# EAGLE design ProSense (EAGLE 7.2.0)
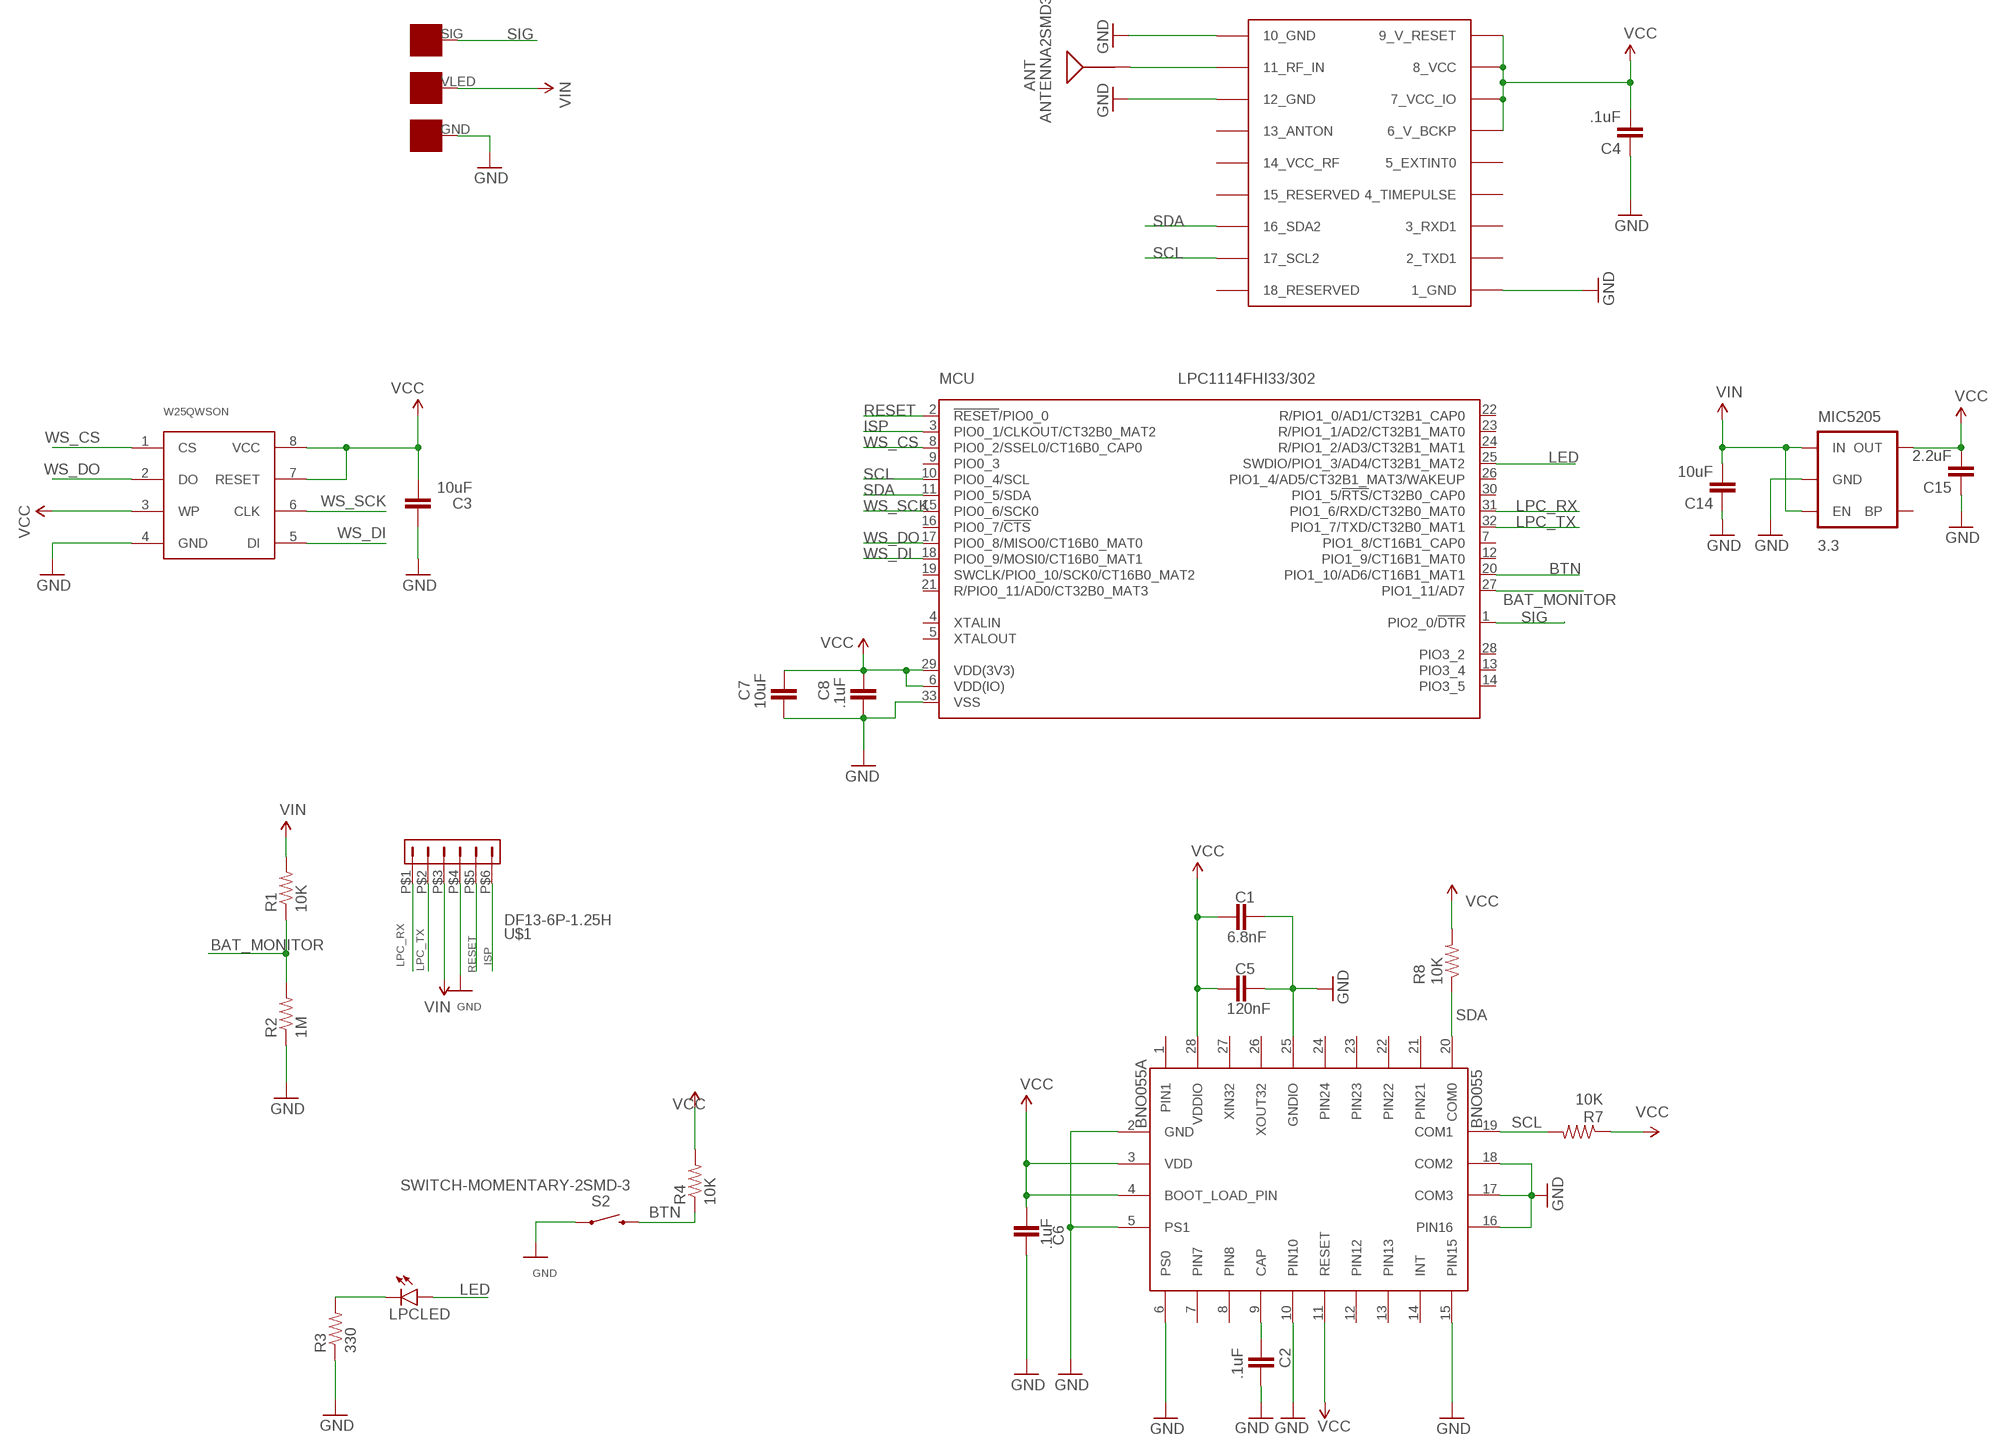
[diagram p0: schematic, sheet 1]

## Parts
ANT  ANTENNA2SMD3  [ANTENNA-CHIP4]
BNO055  BNO055A  [BNO055]
C1  6.8nF  CAP0603-CAP  [0603-CAP]
C2  .1uF  CAP0603-CAP  [0603-CAP]
C3  10uF  CAP0603-CAP  [0603-CAP]
C4  .1uF  CAP0603-CAP  [0603-CAP]
C5  120nF  CAP0603-CAP  [0603-CAP]
C6  .1uF  CAP0603-CAP  [0603-CAP]
C7  10uF  CAP0603-CAP  [0603-CAP]
C8  .1uF  CAP0603-CAP  [0603-CAP]
C14  10uF  CAP0603-CAP  [0603-CAP]
C15  2.2uF  CAP0603-CAP  [0603-CAP]
LPCLED  LED0603  [LED-0603]
MCU  LPC1114FHI33/302  [SOT617-3]
MIC5205  3.3  MIC52053.3V  [SOT23-5]
R1  10K  RESISTOR0603-RES  [0603-RES]
R2  1M  RESISTOR0603-RES  [0603-RES]
R3  330  RESISTOR0603-RES  [0603-RES]
R4  10K  RESISTOR0603-RES  [0603-RES]
R7  10K  RESISTOR0603-RES  [0603-RES]
R8  10K  RESISTOR0603-RES  [0603-RES]
S2  SWITCH-MOMENTARY-2SMD-3  [TACTILE_SWITCH_SMD-3]
U$1  DF13-6P-1.25H  [DF13A-6P-1.25H]
U$2  UBLOX_MAX  [UBLOX_MAX]
U$4  CON  [COPPER-PAD]
W25QWSON  W25Q128FVWSON  [WSON-8-PAD]

## Nets
BAT_MONITOR: MCU.27(PIO1_11/AD7) R1.1 R2.2
BTN: MCU.20(PIO1_10/AD6/CT16B1_MAT1) R4.1 S2.4
GND: BNO055.2(GND) BNO055.5(PS1) BNO055.6(PS0) BNO055.10(PIN10) BNO055.15(PIN15) BNO055.16(PIN16) BNO055.17(COM3) BNO055.18(COM2) BNO055.25(GNDIO) C1.1 C2.1 C3.1 C4.1 C5.1 C6.2 C7.2 C8.2 C14.1 C15.1 MCU.33(VSS) MIC5205.2(GND) R2.1 R3.1 S2.1 U$1.P$4 U$2.1_GND U$2.10_GND U$2.12_GND U$4.GND W25QWSON.4(GND)
ISP: MCU.3(PIO0_1/CLKOUT/CT32B0_MAT2) U$1.P$6
LED: LPCLED.A MCU.25(SWDIO/PIO1_3/AD4/CT32B1_MAT2)
LPC_RX: MCU.31(PIO1_6/RXD/CT32B0_MAT0) U$1.P$1
LPC_TX: MCU.32(PIO1_7/TXD/CT32B0_MAT1) U$1.P$2
N$1: ANT.SIG(SIGNAL) U$2.11_RF_IN
N$2: BNO055.9(CAP) C2.2
N$5: LPCLED.C R3.2
RESET: MCU.2(!RESET!/PIO0_0) U$1.P$5
SCL: BNO055.19(COM1) MCU.10(PIO0_4/SCL) R7.2 U$2.17_SCL2
SDA: BNO055.20(COM0) MCU.11(PIO0_5/SDA) R8.1 U$2.16_SDA2
SIG: MCU.1(PIO2_0/!DTR!) U$4.SIG
VCC: BNO055.3(VDD) BNO055.4(BOOT_LOAD_PIN) BNO055.11(RESET) BNO055.28(VDDIO) C1.2 C3.2 C4.2 C5.2 C6.1 C7.1 C8.1 C15.2 MCU.6(VDD(IO)) MCU.29(VDD(3V3)) MIC5205.5(OUT) R4.2 R7.1 R8.2 U$2.6_V_BCKP U$2.7_VCC_IO U$2.8_VCC U$2.9_V_RESET W25QWSON.3(WP) W25QWSON.7(RESET) W25QWSON.8(VCC)
VIN: C14.2 MIC5205.1(IN) MIC5205.3(EN) R1.2 U$1.P$3 U$4.VLED
WS_CS: MCU.8(PIO0_2/SSEL0/CT16B0_CAP0) W25QWSON.1(CS)
WS_DI: MCU.18(PIO0_9/MOSI0/CT16B0_MAT1) W25QWSON.5(DI)
WS_DO: MCU.17(PIO0_8/MISO0/CT16B0_MAT0) W25QWSON.2(DO)
WS_SCK: MCU.15(PIO0_6/SCK0) W25QWSON.6(CLK)
Unconnected: BNO055.1(PIN1) BNO055.7(PIN7) BNO055.8(PIN8) BNO055.12(PIN12) BNO055.13(PIN13) BNO055.14(INT) BNO055.21(PIN21) BNO055.22(PIN22) BNO055.23(PIN23) BNO055.24(PIN24) BNO055.26(XOUT32) BNO055.27(XIN32) MCU.4(XTALIN) MCU.5(XTALOUT) MCU.7(PIO1_8/CT16B1_CAP0) MCU.9(PIO0_3) MCU.12(PIO1_9/CT16B1_MAT0) MCU.13(PIO3_4) MCU.14(PIO3_5) MCU.16(PIO0_7/!CTS!) MCU.19(SWCLK/PIO0_10/SCK0/CT16B0_MAT2) MCU.21(R/PIO0_11/AD0/CT32B0_MAT3) MCU.22(R/PIO1_0/AD1/CT32B1_CAP0) MCU.23(R/PIO1_1/AD2/CT32B1_MAT0) MCU.24(R/PIO1_2/AD3/CT32B1_MAT1) MCU.26(PIO1_4/AD5/CT32B1_MAT3/WAKEUP) MCU.28(PIO3_2) MCU.30(PIO1_5/!RTS!/CT32B0_CAP0) MIC5205.4(BP) U$2.2_TXD1 U$2.3_RXD1 U$2.4_TIMEPULSE U$2.5_EXTINT0 U$2.13_ANTON U$2.14_VCC_RF U$2.15_RESERVED U$2.18_RESERVED

## Library data of the parts
ANT = SparkFun-RF:ANTENNA2: Chip antenna Single endded antenna. Common with smaller chip antennas. CHIP4 package is the GPS Chip Antenna SKU: GPS-08418. CHIP5 package is 2.4GHz chip antenna SKU: WRL-00144.
BNO055 = BNO055:BNO055
C1-C8 C14 C15 = SparkFun-Passives:CAP: Capacitor Standard 0603 ceramic capacitor, and 0.1" leaded capacitor.
LPCLED = SparkFun-LED:LED: LEDs Standard schematic elements and footprints for 5mm, 3mm, 1206, and 0603 sized LEDs. 5mm - Spark Fun Electronics SKU : COM-00529 (and others)
MCU = NXP_60_26022015:LPC1114FHI33/302: 32-bit ARM Cortex-M0 microcontroller; up to 64 kB flash and 8 kB SRAM The LPC1110/11/12/13/14/15 are a ARM Cortex-M0 based, low-cost 32-bit MCU family, designed for 8/16-bit microcontroller applications, offering performance, low power, simple instruction set and memory addressing together with reduced code size compared to existing 8/16-bit architectures. The LPC1110/11/12/13/14/15 operate at CPU frequencies of up to 50 MHz. The peripheral complement of the LPC1110/11/12/13/14/15 includes up to 64 kB of flash memory, up to 8 kB of data memory, one Fast-mode Plus I 2 C-bus interface, one RS-485/EIA-485 UART, up to two SPI interfaces with SSP features, four general purpose counter/timers, a 10-bit ADC, and up to 42 general purpose I/O pins. Remark: The LPC111x series consists of the LPC1100 series (parts LPC111x/101/201/301), LPC1100L series (parts LPC111x/002/102/202/302), and the LPC1100XL series (parts LPC111x/103/203/303/323/333). The LPC1100L and LPC1100XL series include the power profiles, a windowed watchdog timer, and a configurable open-drain mode. AAL Eindhoven MK; ADC: 8; FLASH: 32kB; GPIO: 28; PWR_PROFILES: yes; SERIES: LPC1100L; SPI: 1; SRAM: 8kB
MIC5205 = SparkFun-PowerIC:MIC5205: MIC5205 150mA vreg 3.3V - VREG-00822 5V - VREG-00823; PROD_ID: VREG-00822
R1-R4 R7 R8 = SparkFun-Passives:RESISTOR: Resistor Basic schematic elements and footprints for 0603, 1206, and PTH resistors.
S2 = SparkFun-Electromechanical:SWITCH-MOMENTARY-2: Various NO switches- pushbuttons, reed, etc
U$1 = con-hirose-df13:DF13-6P-1.25: DF13-6P 1.25mm Pitch Miniature Crimping Connector.
U$2 = Ava:UBLOX_MAX: UBLOX MAX
U$4 = Matts-Parts:CON
W25QWSON = Matts-Parts:W25Q128FV: W25Q128FV - SPI Flash Memory Technical Specifications: VCC: 2.6-3.7V Memory Size: 128Mbit or 16Mbytes SPI ~ 100Mhz Digikey: W25Q128FVSIG

## Board
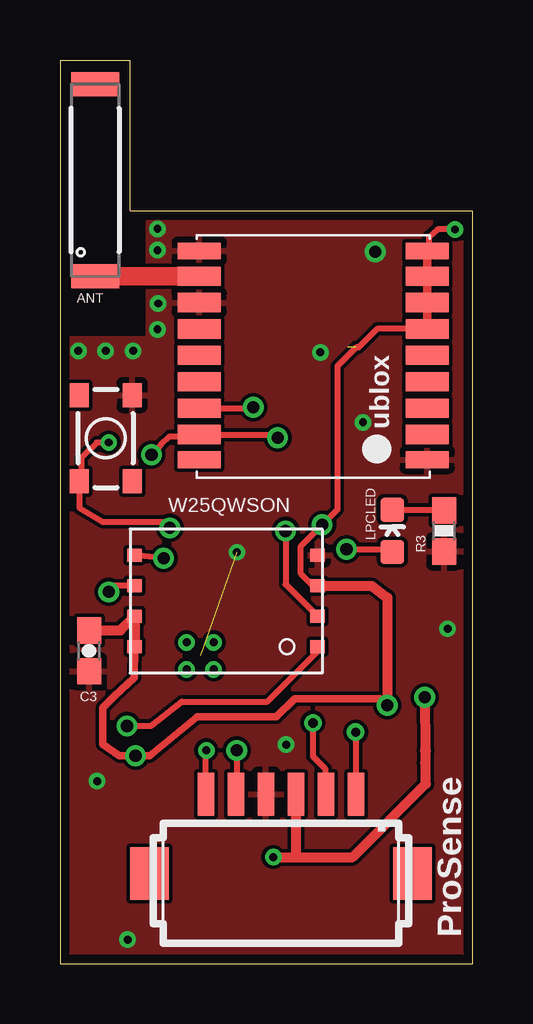
[diagram p1: board, top side]
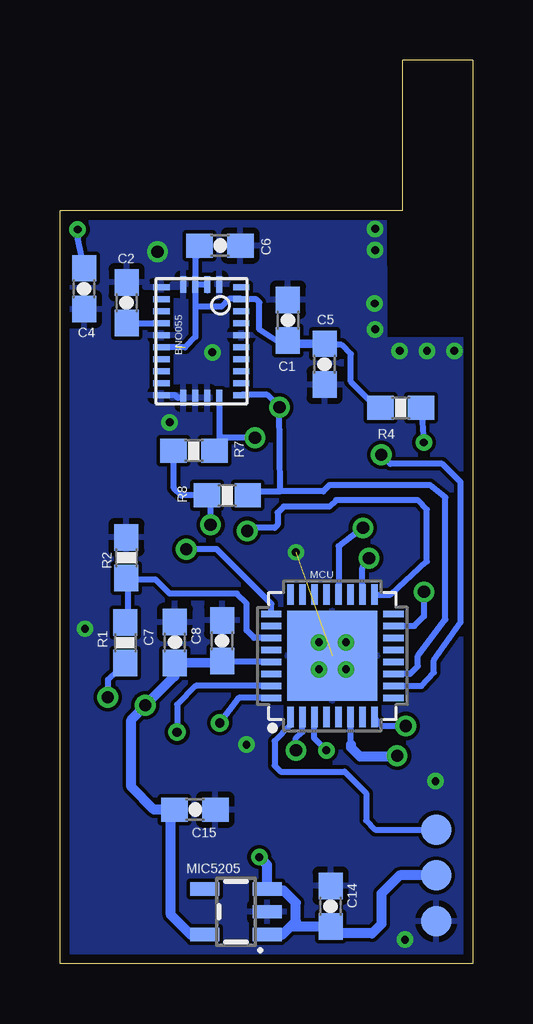
[diagram p2: board, bottom side, seen from below]

Size 17.2 x 37.66 mm. Coordinates in mm from the lower left corner, seen from the top.
Outline: 0,0 17.2,0 17.2,31.37 2.92,31.37 2.92,37.66 0,37.66 0,0
Copper layers (1*16): Top 0.0356mm / dielectric 1.5011mm / Bottom 0.0356mm
Design rules "OSHPARK": minimum track width 6mil, minimum drill 13mil, track to track 6mil, track to pad 6mil, pad to pad 6mil, via to via 6mil, smd to smd 6mil, copper to edge 15mil, drill to drill 6mil, minimum pad ring 7mil, minimum via ring 7mil, stop-mask expansion 3mil, vias tented up to drill 0mil, thermal gap 10mil

### Footprints (pad centres in the part's own frame; a part is rotated, then mirrored left to right if it is on the bottom)
ANTENNA-CHIP4 = smd 1 x 2: NC 4,0; SIG -4,0
BNO055 = smd 0.675 x 0.25: 1 1.663,2.25; 6 -1.665,2.25; 7 -1.665,1.75; 8 -1.665,1.25; 9 -1.665,0.75; 10 -1.665,0.25; 11 -1.665,-0.25; 12 -1.665,-0.75; 13 -1.665,-1.25; 14 -1.665,-1.75; 15 -1.665,-2.25; 20 1.663,-2.25; 21 1.663,-1.75; 22 1.663,-1.25; 23 1.663,-0.75; 24 1.663,-0.25; 25 1.663,0.25; 26 1.663,0.75; 27 1.663,1.25; 28 1.663,1.75 | smd 0.25 x 0.675: 2 0.75,2.362; 3 0.25,2.362; 4 -0.25,2.362; 5 -0.75,2.362; 16 -0.75,-2.362; 17 -0.25,-2.362; 18 0.25,-2.362; 19 0.75,-2.362
0603-CAP = smd 1.1 x 1: 1 -0.85,0; 2 0.85,0
LED-0603 = smd 1 x 1: A 0,-0.877; C 0,0.877
SOT617-3 = smd 0.85 x 0.27: 1 -2.55,1.75; 2 -2.55,1.25; 3 -2.55,0.75; 4 -2.55,0.25; 5 -2.55,-0.25; 6 -2.55,-0.75; 7 -2.55,-1.25; 8 -2.55,-1.75; 17 2.55,-1.75; 18 2.55,-1.25; 19 2.55,-0.75; 20 2.55,-0.25; 21 2.55,0.25; 22 2.55,0.75; 23 2.55,1.25; 24 2.55,1.75 | smd 0.27 x 0.85: 9 -1.75,-2.55; 10 -1.25,-2.55; 11 -0.75,-2.55; 12 -0.25,-2.55; 13 0.25,-2.55; 14 0.75,-2.55; 15 1.25,-2.55; 16 1.75,-2.55; 25 1.75,2.55; 26 1.25,2.55; 27 0.75,2.55; 28 0.25,2.55; 29 -0.25,2.55; 30 -0.75,2.55; 31 -1.25,2.55; 32 -1.75,2.55 | smd 3.75 x 3.75: 33 0,0 | drill 0.33 pad 0.6: 33@1 -0.562,0.562; 33@2 0.562,0.562; 33@3 -0.562,-0.562; 33@4 0.562,-0.562
SOT23-5 = smd 0.55 x 1.2: 1 -0.95,-1.3; 2 0,-1.3; 3 0.95,-1.3; 4 0.95,1.3; 5 -0.95,1.3
0603-RES = smd 1.1 x 1: 1 -0.85,0; 2 0.85,0
TACTILE_SWITCH_SMD-3 = smd 1 x 0.8: 1 -1.8,1.1; 2 1.8,1.1; 3 -1.8,-1.1; 4 1.8,-1.1
DF13A-6P-1.25H = smd 1.6 x 2.2: M$0 -5.475,2.4; M$1 5.475,2.4 | smd 0.7 x 1.8: P$1 -3.125,-0.9; P$2 -1.875,-0.9; P$3 -0.625,-0.9; P$4 0.625,-0.9; P$5 1.875,-0.9; P$6 3.125,-0.9
UBLOX_MAX = smd 1.8 x 0.7: 1_GND 4.95,-4.4; 9_V_RESET 4.95,4.3; 10_GND -4.55,4.3; 18_RESERVED -4.55,-4.4 | smd 1.8 x 0.8: 2_TXD1 4.95,-3.35; 3_RXD1 4.95,-2.25; 4_TIMEPULSE 4.95,-1.15; 5_EXTINT0 4.95,-0.05; 6_V_BCKP 4.95,1.05; 7_VCC_IO 4.95,2.15; 8_VCC 4.95,3.25; 11_RF_IN -4.55,3.25; 12_GND -4.55,2.15; 13_ANTON -4.55,1.05; 14_VCC_RF -4.55,-0.05; 15_RESERVED -4.55,-1.15; 16_SDA2 -4.55,-2.25; 17_SCL2 -4.55,-3.35
COPPER-PAD = smd 1.27 x 1.27: GND 0,0; SIG 3.81,0; VLED 1.905,0
WSON-8-PAD = smd 0.6 x 0.53: 1 -3.81,1.905; 2 -3.81,0.635; 3 -3.81,-0.635; 4 -3.81,-1.905; 5 3.81,-1.905; 6 3.81,-0.635; 7 3.81,0.635; 8 3.81,1.905

### Placement (x,y rotation side)
ANT  1.46,32.65 90 top
BNO055  11.3,25.94 0 bottom
C1  7.7,26.81 270 bottom
C2  14.42,27.54 270 bottom
C3  1.21,13.04 90 top
C4  16.19,28.13 90 bottom
C5  6.17,24.98 90 bottom
C6  10.53,29.92 0 bottom
C7  12.41,13.39 90 bottom
C8  10.45,13.46 90 bottom
C14  5.92,2.39 270 bottom
C15  11.57,6.43 180 bottom
LPCLED  13.84,18.03 0 top
MCU  5.84,12.83 90 bottom
MIC5205  9.86,2.17 90 bottom
R1  14.48,13.37 270 bottom
R2  14.43,16.92 270 bottom
R3  16,18.03 90 top
R4  3,23.16 180 bottom
R7  11.61,21.37 0 bottom
R8  10.22,19.51 180 bottom
S2  1.91,21.89 270 top
U$1  9.21,6.16 180 top
U$2  10.35,25.4 0 top
U$4  1.52,1.78 90 bottom
W25QWSON  6.92,15.11 180 top

### Tracks (layer width: path | path; a pad name or v marks a point on that pad's centre or on a via)
BAT_MONITOR
  Bottom 0.254: MCU.27 9.11,13.58 9.42,13.89 9.42,15.01 9.83,15.42 12.62,15.42 13.21,16 14.36,16 | 14.36,16 R2.2 | 14.36,16 14.36,14.53 R1.1
BTN  (via drill 0.33, 0.51)
  Top 0.254: v4.57,18.16 4.32,18.41 1.78,18.41 0.81,19.01 S2.4 0.89,20.01 0.89,21.08 1.52,21.72 v2.03,21.72
  Bottom 0.254: v4.57,18.16 5.59,17.4 MCU.20 | R4.1 v2.03,21.72
GND  (via drill 0.33, 0.51)  (1 unrouted)
  Bottom 0.254: BNO055.16 12.29,23.58 12.4,23.69 BNO055.15
  other vias: 12.62,22.56 13.13,29.67 9.42,9.13 7.37,17.14 10.85,25.48 1.55,7.61 2.82,1 4.06,29.73 4.06,30.62 4.06,26.43 0.76,25.54 1.91,25.54 3.05,25.54 4.09,27.51 16.15,13.96
  pour Top: 0.06,26.05 3.7,26.06 3.7,31.38 17.26,31.33 17.26,0.03 0.06,0.06
  pour Bottom: 0.01,25.98 0,0 17.2,-0.04 17.2,31.36 3.71,31.36 3.7,26.81 3.7,26.01 0.01,26.01
ISP  (via drill 0.33)
  Top 0.254: U$1.P$6 6.08,8.88 v6.1,8.89
  Bottom 0.254: v6.1,8.89 6.6,9.4 6.6,10.27 MCU.3
LED  (via drill 0.51)
  Top 0.254: v11.94,17.27 13.73,17.27 LPCLED.A
  Bottom 0.254: MCU.25 8.39,15 10.67,17.27 v11.94,17.27
LPC_RX  (via drill 0.38)
  Top 0.254: v12.32,9.65 12.32,7.07 U$1.P$1
  Bottom 0.254: MCU.31 11.54,11.58 12.32,10.79 v12.32,9.65
LPC_TX  (via drill 0.38)
  Top 0.254: v10.54,10.03 10.54,8.64 11.05,8.13 11.05,7.09 U$1.P$2
  Bottom 0.254: MCU.32 9.75,11.08 v10.54,10.03
N$1
  Top 0.762: ANT.SIG U$2.11_RF_IN
N$2
  Bottom 0.254: C2.2 12.98,26.68 BNO055.9
N$5
  Top 0.254: LPCLED.C 15.97,18.91 R3.2
RESET  (via drill 0.51)
  Top 0.254: v7.37,8.89 7.37,7.09 U$1.P$5
  Bottom 0.254: v7.37,8.89 7.37,9.4 7.1,9.65 7.09,10.24 MCU.2
SCL  (via drill 0.51)
  Top 0.254: v3.81,21.21 3.98,21.26 4.23,21.65 4.57,21.97 5.09,21.97 U$2.17_SCL2 8.94,22.05 v9.07,21.92
  Bottom 0.254: BNO055.19 10.55,22.05 | 10.55,22.05 10.55,21.28 R7.2 10.6,21.03 | MCU.10 2.14,11.58 1.61,12.14 1.61,12.64 0.51,14.22 0.51,20.07 1.27,20.83 3.43,20.83 v3.81,21.21 | v9.07,21.92 10.43,21.92 10.55,22.05
SDA  (via drill 0.51)
  Top 0.254: U$2.16_SDA2 8.01,23.15 v8.05,23.19
  Bottom 0.254: 9.33,19.56 R8.1 9.2,19.68 8.03,19.68 | BNO055.20 8.56,23.7 v8.05,23.19 8.03,19.68 | 8.03,19.68 6.22,19.68 5.97,19.94 1.78,19.94 1.14,19.43 1.14,14.35 2.29,12.83 2.29,12.39 2.6,12.08 MCU.11
SIG
  Bottom 0.254: MCU.1 7.59,9.93 8.26,9.27 8.26,8.26 8,8 5.33,8 4.45,7.11 4.45,5.97 4.06,5.59 U$4.SIG
VCC  (via drill 0.33, 0.51)  (1 unrouted)
  Top 0.254: W25QWSON.3 10.54,15.75 10.03,16.26 10.03,17.4 v10.92,18.29 | 13.34,11.05 v13.64,10.77 | 11.05,18.41 v10.92,18.29 | v16.46,30.59 15.73,30.59 15.37,30.28 15.37,29.56 U$2.9_V_RESET | U$2.6_V_BCKP 13.21,26.45 12.45,25.69 12.35,25.69 11.56,24.89 11.56,18.92 v10.92,18.29
  Top 0.305: W25QWSON.8 3.1,11.93 2.29,11.18 1.78,10.67 1.78,9.14 2.46,8.66 v3.15,8.66 3.73,8.66 5.71,10.29 9.02,10.29 9.78,11.05 13.34,11.05
  Top 0.356: U$2.9_V_RESET U$2.8_VCC U$2.7_VCC_IO U$2.6_V_BCKP
  Top 0.406: W25QWSON.8 W25QWSON.7 2.52,13.89 C3.2 | W25QWSON.3 12.99,15.75 13.64,15.25 v13.64,10.77
  Bottom 0.254: BNO055.4 11.55,29.52 11.4,29.52 C6.1 | BNO055.4 BNO055.3 11.05,28.05 | BNO055.28 | BNO055.4 11.55,27.45 | 11.55,27.45 11.55,26.12 11.98,25.69 BNO055.11 | BNO055.28 10.15,27.7 10.46,27.38 11.49,27.38 11.55,27.45 | 12.42,20.96 R7.1 12.45,21.36 12.45,19.81 12.15,19.51 R8.2 10.92,19.36 v10.92,18.29 | MCU.29 10.42,12.58 C8.1 | C4.2 16.45,30.24 v16.46,30.59 | C1.2 7.8,25.71 8.89,26.42 8.89,27.56 9.02,27.69 BNO055.28 | R4.2 3.99,23.16 5.08,24.26 5.08,25.4 5.46,25.78 6.38,25.78 C5.2 | MCU.6 5.09,9.16 5.08,9.14
  Bottom 0.356: C5.2 7.69,25.83 C1.2
  Bottom 0.406: C8.1 10.45,12.56 C7.1 12.43,11.98 v13.64,10.77 14.22,10.16 14.22,7.37 13.28,6.43 C15.2 12.57,6.44 12.57,2.03 11.76,1.22 MIC5205.5 | 5.08,9.14 5.08,9.02 4.7,8.64 3.17,8.64 v3.15,8.66
VIN  (via drill 0.33, 0.51)
  Top 0.406: v15.2,11.1 15.21,8.89 | 15.21,8.89 15.21,8.36 | v8.89,4.45 9.78,4.45 | 9.78,4.45 12.19,4.45 15.24,7.49 15.24,8.86 15.21,8.89 | U$1.P$3 9.83,4.5 9.78,4.45
  Bottom 0.254: R1.2 15.2,11.84 v15.2,11.1
  Bottom 0.406: MIC5205.1 7.93,1.22 7.6,1.54 | 7.6,1.54 7.37,1.78 7.37,2.54 7.87,3.05 8.62,3.05 MIC5205.3 8.56,4.12 v8.89,4.45 | U$4.VLED 3.05,3.68 3.81,2.92 3.81,1.65 4.19,1.27 5.91,1.27 C14.2 7.6,1.54
WS_CS  (via drill 0.51)
  Top 0.254: W25QWSON.1 10.73,13.02 8.64,10.92 5.08,10.92 3.8,9.91 v2.79,9.91
  Bottom 0.254: MCU.8 3.8,9.91 v2.79,9.91
WS_DI  (via drill 0.51)
  Top 0.254: v4.32,16.89 W25QWSON.5
  Bottom 0.254: MCU.18 4.59,16.49 v4.32,16.89
WS_DO  (via drill 0.51)
  Top 0.254: v9.4,18.03 9.4,15.81 W25QWSON.2
  Bottom 0.254: MCU.17 3.42,15.38 1.91,16.76 1.91,18.92 2.3,19.32 5.69,19.32 5.97,19.05 7.87,19.05 8.13,18.8 8.13,18.29 8.26,18.16 9.27,18.16 v9.4,18.03
WS_SCK  (via drill 0.51)
  Top 0.254: W25QWSON.6 2.29,15.75 v2.03,15.49
  Bottom 0.254: v2.03,15.49 2.03,14.48 2.43,14.08 MCU.15

### Text on the board
tNames: ProSense